# EAGLE design M2500X (EAGLE 6.6.0)
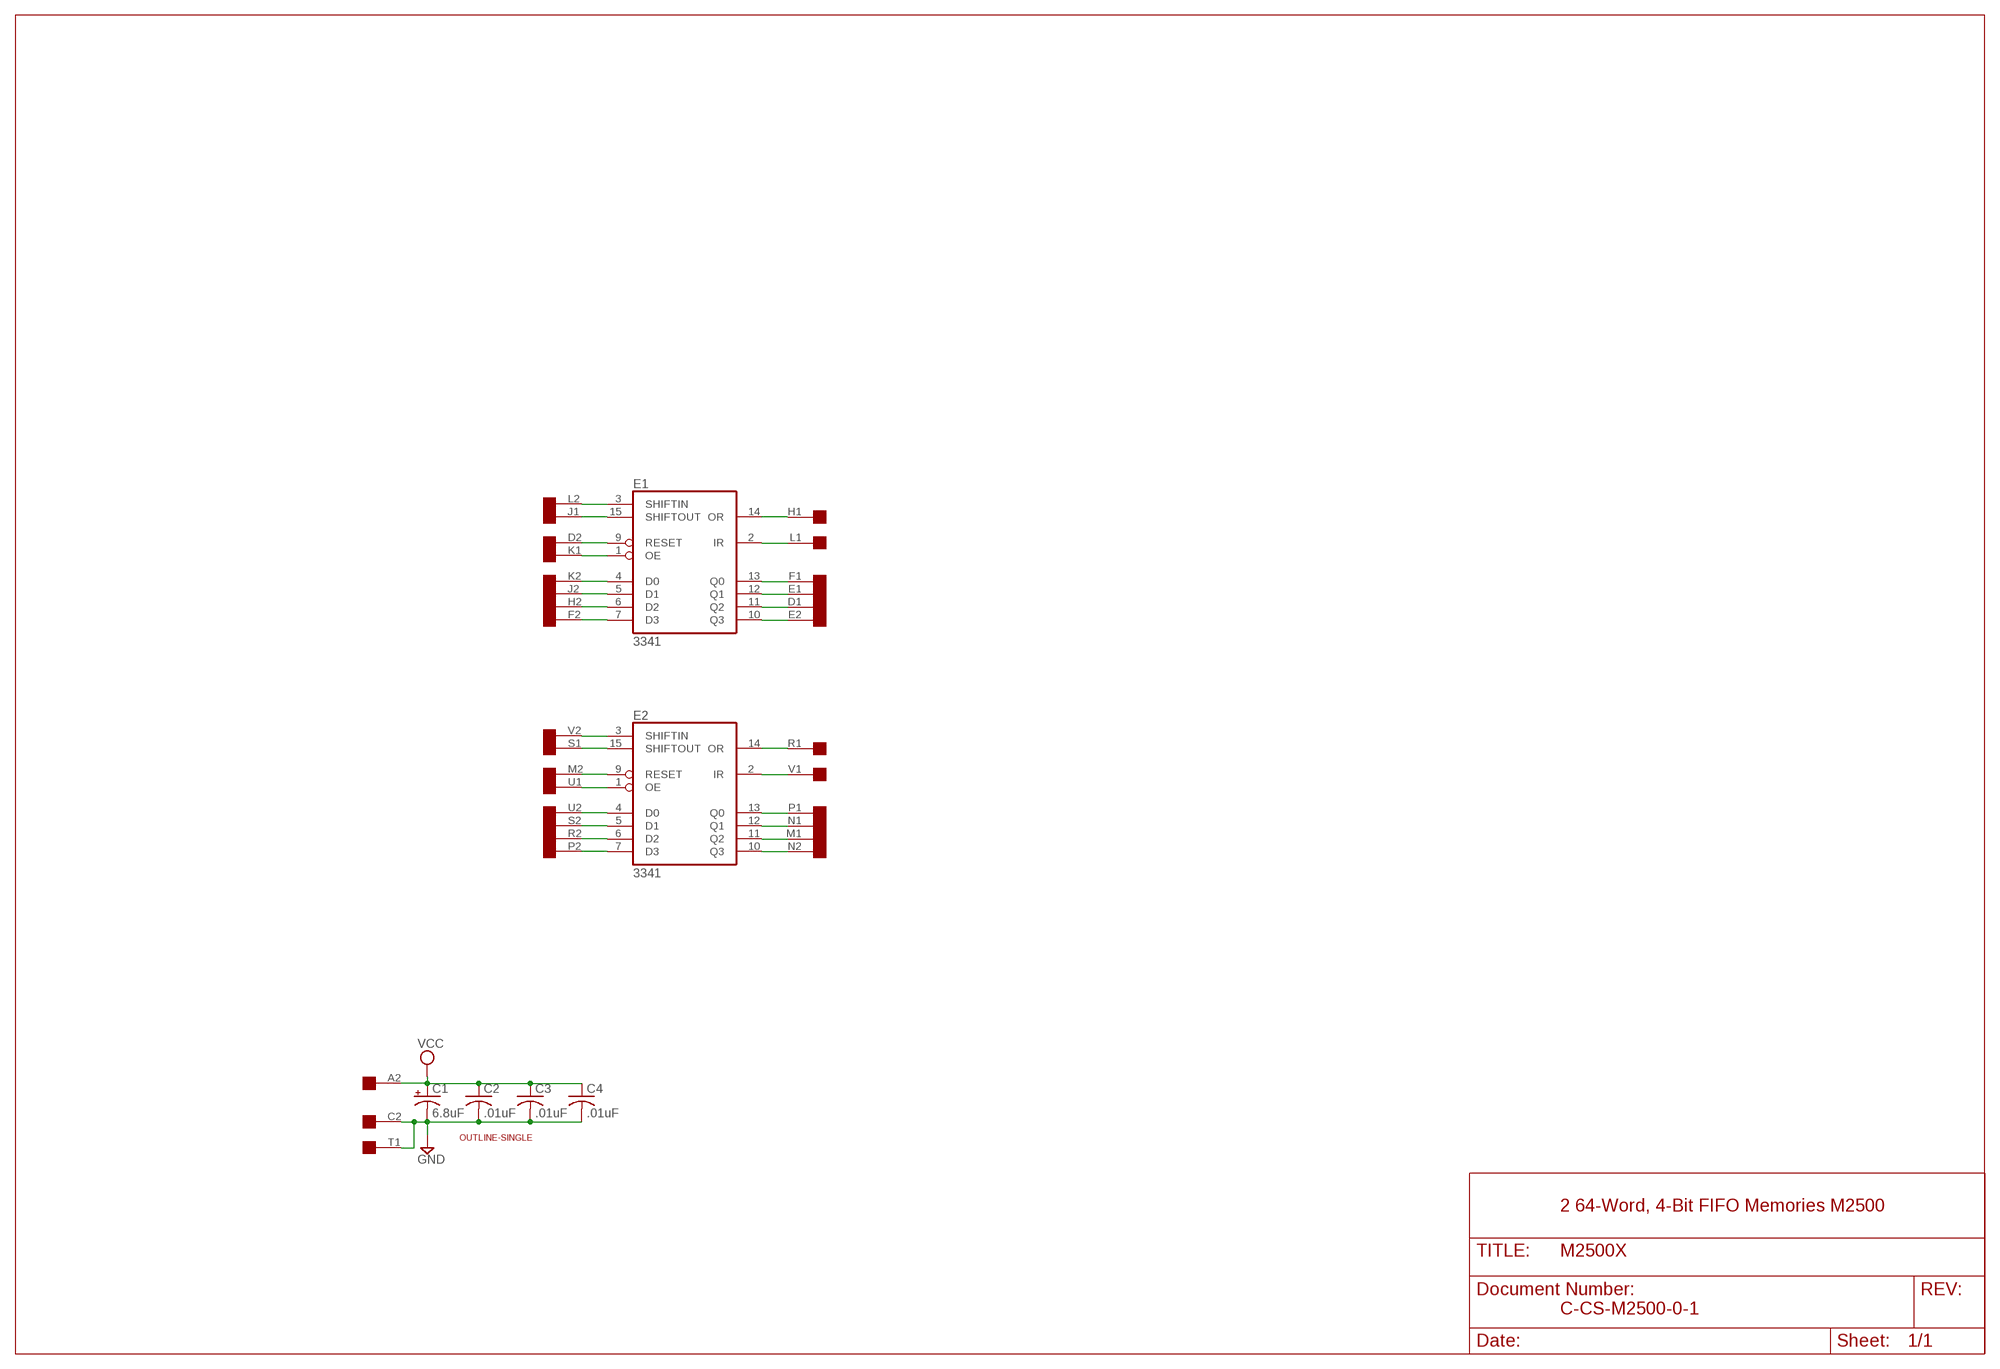
[diagram p0: schematic, sheet 1]

## Parts
C1  6.8uF  CPOL-USE20-8AXIAL  [E12-8]
C2  .01uF  C-US050-025X075  [C050-025X075]
C3  .01uF  C-US050-025X075  [C050-025X075]
C4  .01uF  C-US050-025X075  [C050-025X075]
E1  3341  67C4013  [DIL16]
E2  3341  67C4013  [DIL16]
U$1  OUTLINE-SINGLE  [SINGLE]
U$2  SINGLE  [EDGE-CON2]

## Nets
D1: E1.11(Q2) U$2.D1
D2: E1.9(RESET) U$2.D2
E1: E1.12(Q1) U$2.E1
E2: E1.10(Q3) U$2.E2
F1: E1.13(Q0) U$2.F1
F2: E1.7(D3) U$2.F2
GND: C1.- C2.2 C3.2 C4.2 U$2.C2 U$2.T1
H1: E1.14(OR) U$2.H1
H2: E1.6(D2) U$2.H2
J1: E1.15(SHIFTOUT) U$2.J1
J2: E1.5(D1) U$2.J2
K1: E1.1(OE) U$2.K1
K2: E1.4(D0) U$2.K2
L1: E1.2(IR) U$2.L1
L2: E1.3(SHIFTIN) U$2.L2
M1: E2.11(Q2) U$2.M1
M2: E2.9(RESET) U$2.M2
N1: E2.12(Q1) U$2.N1
N2: E2.10(Q3) U$2.N2
P1: E2.13(Q0) U$2.P1
P2: E2.7(D3) U$2.P2
R1: E2.14(OR) U$2.R1
R2: E2.6(D2) U$2.R2
S1: E2.15(SHIFTOUT) U$2.S1
S2: E2.5(D1) U$2.S2
U1: E2.1(OE) U$2.U1
U2: E2.4(D0) U$2.U2
V1: E2.2(IR) U$2.V1
V2: E2.3(SHIFTIN) U$2.V2
VCC: C1.+ C2.1 C3.1 C4.1 U$2.A2
Unconnected: U$2.A1 U$2.B1 U$2.B2 U$2.C1 U$2.T2

## Notes on the sheet
- 2 64-Word, 4-Bit FIFO Memories M2500
- C-CS-M2500-0-1

## Power pins joined to a net without a drawn wire
GND: E1.8(GND) E2.8(GND)
VCC: E1.16(VCC) E2.16(VCC)

## Library data of the parts
C1 = dec-con:CPOL-USE20-8AXIAL: A 0.8 inch electrolytic.
C2-C4 = rcl:C-US: CAPACITOR, American symbol
E1 E2 = fifo:67C4013: FIFO; OC_FARNELL: unknown; OC_NEWARK: unknown
U$1 = dec-con:OUTLINE-*: Board outlines for DEC boards.
U$2 = dec-con:SINGLE: Single-Height DEC board

## Net classes
0 default: width 0.813 mm

## Board
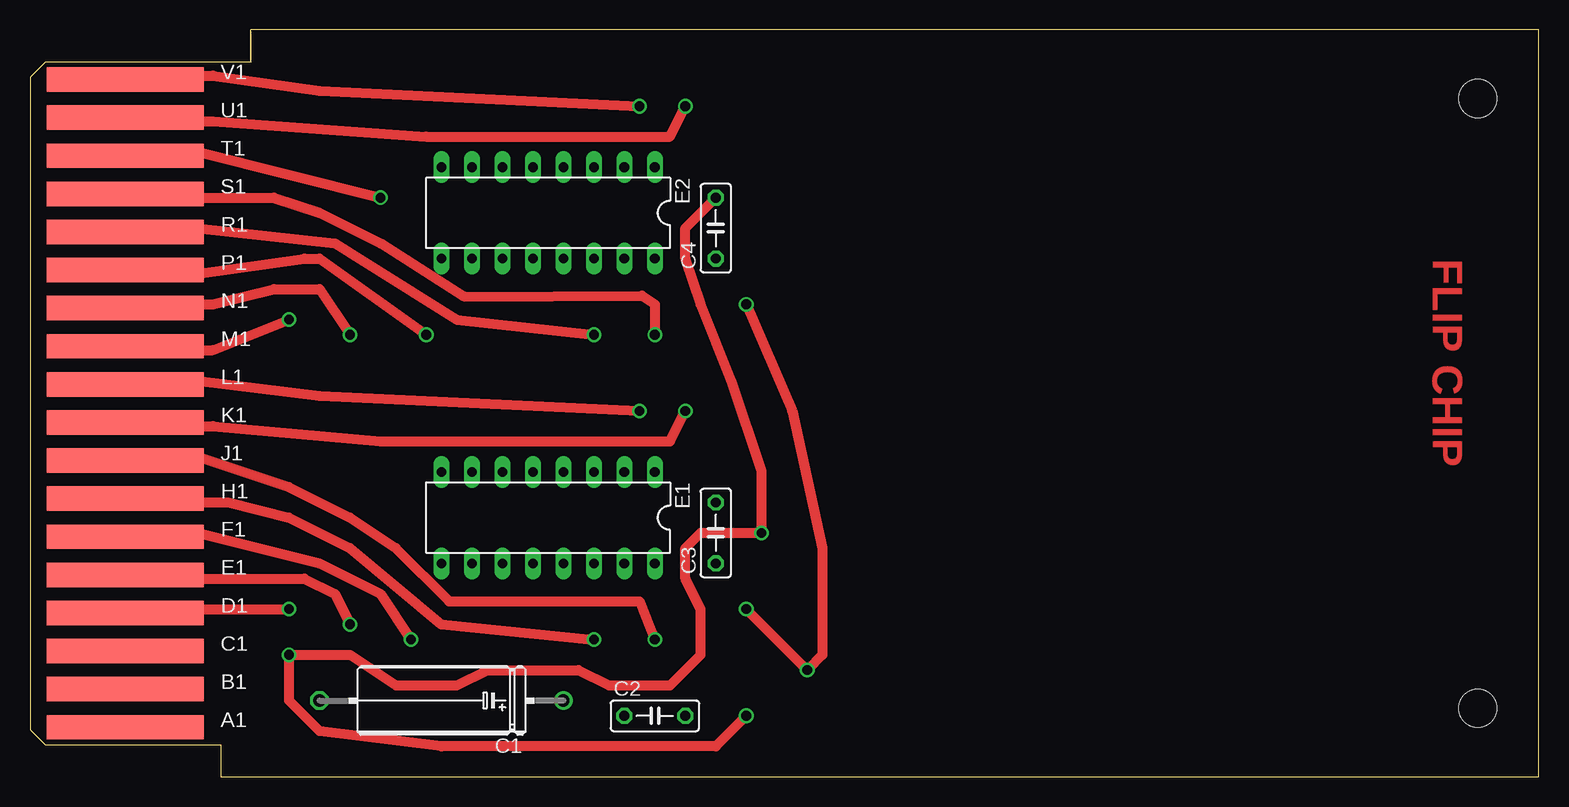
[diagram p1: board, top side]
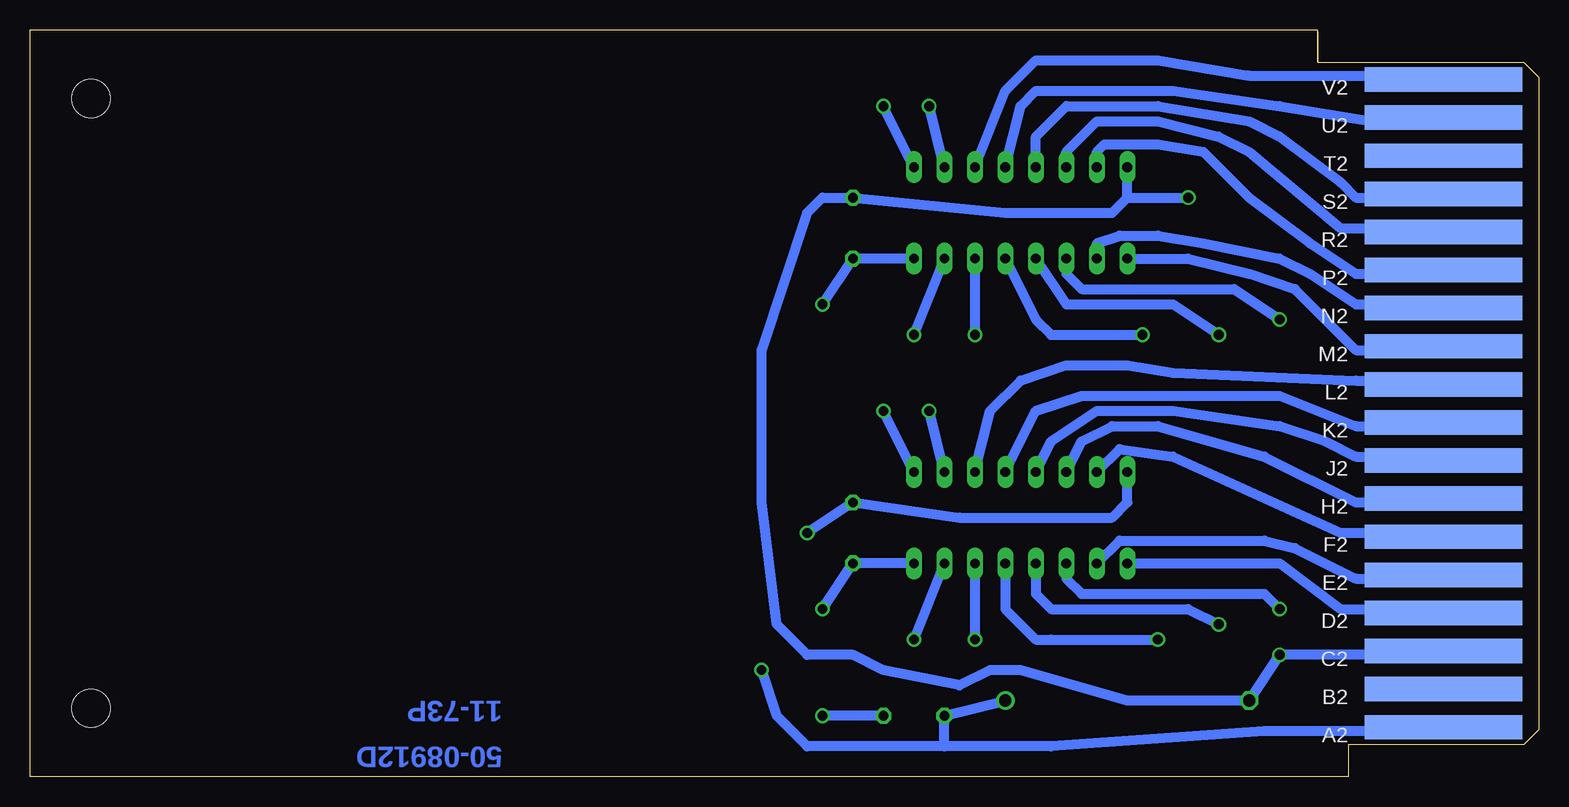
[diagram p2: board, bottom side, seen from below]

Size 125.73 x 62.23 mm. Coordinates in mm from the lower left corner, seen from the top.
Copper layers (1+16): Top 0.035mm / dielectric 1.5mm / Bottom 0.035mm
Design rules "16mils": minimum track width 16mil, minimum drill 32mil, track to track 15mil, track to pad 10mil, pad to pad 10mil, via to via 10mil, smd to smd 10mil, copper to edge 13mil, drill to drill 10mil, minimum pad ring 10mil, minimum via ring 8mil, stop-mask expansion 0mil, vias tented up to drill 0mil, thermal gap 10mil

### Footprints (pad centres in the part's own frame; a part is rotated, then mirrored left to right if it is on the bottom)
E12-8 = drill 1.016: + -10.16,0 | drill 1.016 octagon: - 10.16,0
C050-025X075 = drill 0.813 octagon: 1 -2.54,0; 2 2.54,0
DIL16 = drill 0.813 long: 1 -8.89,-3.81; 2 -6.35,-3.81; 3 -3.81,-3.81; 4 -1.27,-3.81; 5 1.27,-3.81; 6 3.81,-3.81; 7 6.35,-3.81; 8 8.89,-3.81; 9 8.89,3.81; 10 6.35,3.81; 11 3.81,3.81; 12 1.27,3.81; 13 -1.27,3.81; 14 -3.81,3.81; 15 -6.35,3.81; 16 -8.89,3.81
SINGLE = hole 3.175: 120.65,56.515; 120.65,5.715
EDGE-CON2 = smd 13.106 x 2.032: A1 7.938,4.128; B1 7.938,7.303; C1 7.938,10.477; D1 7.938,13.652; E1 7.938,16.828; F1 7.938,20.003; H1 7.938,23.177; J1 7.938,26.352; K1 7.938,29.527; L1 7.938,32.703; M1 7.938,35.877; N1 7.938,39.053; P1 7.938,42.227; R1 7.938,45.403; S1 7.938,48.578; T1 7.938,51.752; U1 7.938,54.928; V1 7.938,58.102 | smd 13.106 x 2.032 bottom: A2 7.938,4.128; B2 7.938,7.303; C2 7.938,10.477; D2 7.938,13.652; E2 7.938,16.828; F2 7.938,20.003; H2 7.938,23.177; J2 7.938,26.352; K2 7.938,29.527; L2 7.938,32.703; M2 7.938,35.877; N2 7.938,39.053; P2 7.938,42.227; R2 7.938,45.403; S2 7.938,48.578; T2 7.938,51.752; U2 7.938,54.928; V2 7.938,58.102

### Placement (x,y rotation side)
C1  34.29,6.35 180 top
C2  52.07,5.08 0 top
C3  57.15,20.32 90 top
C4  57.15,45.72 90 top
E1  43.18,21.59 180 top
E2  43.18,46.99 180 top
U$1  0,0 0 top
U$2  0,0 0 top

### Tracks (layer width: path | path; a pad name or v marks a point on that pad's centre or on a via)
D1  (via drill 0.81)
  Top 0.813: U$2.D1 8.89,13.97 v21.59,13.97
  Bottom 0.813: E1.11 39.37,16.51 38.1,15.24 24.13,15.24 22.86,15.24 v21.59,13.97
D2
  Bottom 0.813: E1.9 21.59,17.78 16.51,13.97 8.89,13.97 U$2.D2
E1  (via drill 0.81)
  Top 0.813: U$2.E1 8.89,16.51 22.86,16.51 25.4,15.24 v26.67,12.7
  Bottom 0.813: E1.12 41.91,15.24 40.64,13.97 29.21,13.97 v26.67,12.7
E2
  Bottom 0.813: E1.10 34.93,19.68 22.86,19.68 20.32,19.05 15.24,16.51 8.89,16.51 U$2.E2
F1  (via drill 0.81)
  Top 0.813: U$2.F1 8.89,20.32 13.97,20.32 24.13,17.78 29.21,15.24 v31.75,11.43
  Bottom 0.813: E1.13 44.45,15.24 44.45,13.97 41.91,11.43 40.64,11.43 v31.75,11.43
F2
  Bottom 0.813: E1.7 34.93,27.3 30.48,26.67 16.51,20.32 8.89,20.32 U$2.F2
GND  (via drill 0.81)
  Top 0.813: v59.69,5.08 57.15,2.54 34.29,2.54 24.13,3.81 21.59,6.35 v21.59,10.16 26.67,10.16 30.48,7.62 35.56,7.62 38.1,8.89 45.72,8.89 48.26,7.62 53.34,7.62 55.88,10.16 55.88,13.97 54.61,16.51 54.61,19.05 55.88,20.32 v60.96,20.32 60.96,25.4 58.42,33.02 55.88,39.37 54.61,43.18 54.61,45.72 C4.2 | U$2.T1 8.89,52.07 13.97,52.07 v29.21,48.26
  Bottom 0.813: U$2.C2 8.89,10.16 v21.59,10.16 C1.- 34.29,6.35 43.18,8.89 45.72,8.89 48.26,7.62 54.61,8.89 57.15,10.16 60.96,10.16 63.5,12.7 64.77,22.86 64.77,35.56 60.96,46.99 59.69,48.26 C4.2 44.45,46.99 35.56,46.99 34.29,48.26 | C2.2 v59.69,5.08 | E1.8 34.29,22.86 35.56,21.59 48.26,21.59 C3.2 v60.96,20.32 | 34.29,48.26 E2.8 | 34.29,48.26 v29.21,48.26
H1  (via drill 0.81)
  Top 0.813: U$2.H1 8.89,22.86 16.51,22.86 21.59,21.59 26.67,19.05 34.29,12.7 v46.99,11.43
  Bottom 0.813: E1.14 v46.99,11.43
H2
  Bottom 0.813: E1.6 38.1,27.94 35.56,29.21 31.75,29.21 22.86,26.67 15.24,22.86 8.89,22.86 U$2.H2
J1  (via drill 0.81)
  Top 0.813: U$2.J1 8.89,26.67 13.97,26.67 21.59,24.13 26.67,21.59 30.48,19.05 34.93,14.61 35.56,14.61 50.8,14.61 50.84,14.5 v52.07,11.43
  Bottom 0.813: E1.15 v52.07,11.43
J2
  Bottom 0.813: E1.5 40.64,27.94 36.83,30.48 30.48,30.48 21.59,29.21 17.78,27.94 15.24,26.67 8.89,26.67 U$2.J2
K1  (via drill 0.81)
  Top 0.813: U$2.K1 8.89,29.21 15.24,29.21 29.21,27.94 53.34,27.94 v54.61,30.48
  Bottom 0.813: E1.1 v54.61,30.48
K2
  Bottom 0.813: E1.4 41.91,30.48 38.1,31.75 21.59,31.75 15.24,29.21 8.89,29.21 U$2.K2
L1  (via drill 0.81)
  Top 0.813: U$2.L1 8.89,33.02 13.97,33.02 24.13,31.75 v50.8,30.48
  Bottom 0.813: E1.2 v50.8,30.48
L2
  Bottom 0.813: E1.3 45.72,30.48 43.18,33.02 39.37,34.29 34.29,34.29 30.48,33.66 15.24,33.02 8.89,33.02 U$2.L2
M1  (via drill 0.81)
  Top 0.813: U$2.M1 8.89,35.56 15.24,35.56 v21.59,38.1
  Bottom 0.813: E2.11 39.37,41.91 38.1,40.64 25.4,40.64 v21.59,38.1
M2
  Bottom 0.813: E2.9 29.21,43.18 24.13,41.91 20.32,40.64 15.24,35.56 8.89,35.56 U$2.M2
N1  (via drill 0.81)
  Top 0.813: U$2.N1 8.89,39.37 15.24,39.37 20.32,40.64 24.13,40.64 v26.67,36.83
  Bottom 0.813: E2.12 39.37,39.37 30.48,39.37 v26.67,36.83
N2
  Bottom 0.813: E2.10 36.83,44.45 34.93,45.09 31.75,45.09 27.94,44.45 21.59,43.18 19.05,41.91 15.24,39.37 8.89,39.37 U$2.N2
P1  (via drill 0.81)
  Top 0.813: U$2.P1 8.89,41.91 13.97,41.91 22.86,43.18 24.13,43.18 v33.02,36.83
  Bottom 0.813: E2.13 41.91,38.1 40.64,36.83 v33.02,36.83
P2
  Bottom 0.813: E2.7 36.83,52.07 36.2,52.7 31.75,52.7 27.94,52.07 24.13,48.26 19.05,44.45 15.24,41.91 8.89,41.91 U$2.P2
R1  (via drill 0.81)
  Top 0.813: U$2.R1 8.89,45.72 13.97,45.72 25.4,44.45 35.56,38.1 v46.99,36.83
  Bottom 0.813: E2.14 v46.99,36.83
R2
  Bottom 0.813: E2.6 39.37,52.07 36.83,54.61 31.75,54.61 26.67,53.34 24.13,52.07 16.51,45.72 8.89,45.72 U$2.R2
S1  (via drill 0.81)
  Top 0.813: U$2.S1 8.89,48.26 20.32,48.26 24.13,46.99 29.21,44.45 36.2,40.01 51.02,40.09 52.07,39.37 v52.07,36.83
  Bottom 0.813: E2.15 v52.07,36.83
S2
  Bottom 0.813: E2.5 41.91,53.34 39.37,55.88 31.75,55.88 24.13,54.61 21.59,53.34 16.51,49.53 15.24,48.26 8.89,48.26 U$2.S2
U1  (via drill 0.81)
  Top 0.813: U$2.U1 8.89,54.61 15.24,54.61 33.02,53.34 53.34,53.34 v54.61,55.88
  Bottom 0.813: E2.1 v54.61,55.88
U2
  Bottom 0.813: E2.4 43.18,55.88 41.91,57.15 30.48,57.15 21.59,55.88 13.97,54.61 8.89,54.61 U$2.U2
V1  (via drill 0.81)
  Top 0.813: U$2.V1 8.89,58.42 15.24,58.42 24.13,57.15 v50.8,55.88
  Bottom 0.813: E2.2 v50.8,55.88
V2
  Bottom 0.813: E2.3 44.45,57.15 41.91,59.69 31.75,59.69 24.13,58.42 8.89,58.42 U$2.V2
VCC  (via drill 0.81)
  Top 0.813: v59.69,13.97 v64.77,8.89 66.04,10.16 66.04,19.05 63.5,30.48 v59.69,39.37
  Bottom 0.813: U$2.A2 8.89,4.13 8.89,3.81 22.86,3.81 40.64,2.54 49.53,2.54 | 49.53,2.54 C2.1 C1.+ | 49.53,2.54 60.96,2.54 63.5,5.08 v64.77,8.89 | E2.16 C4.1 v59.69,39.37 | v59.69,13.97 C3.1 E1.16

### Text on the board
Top: FLIP CHIP
Bottom: 11-73P | 50-08912D